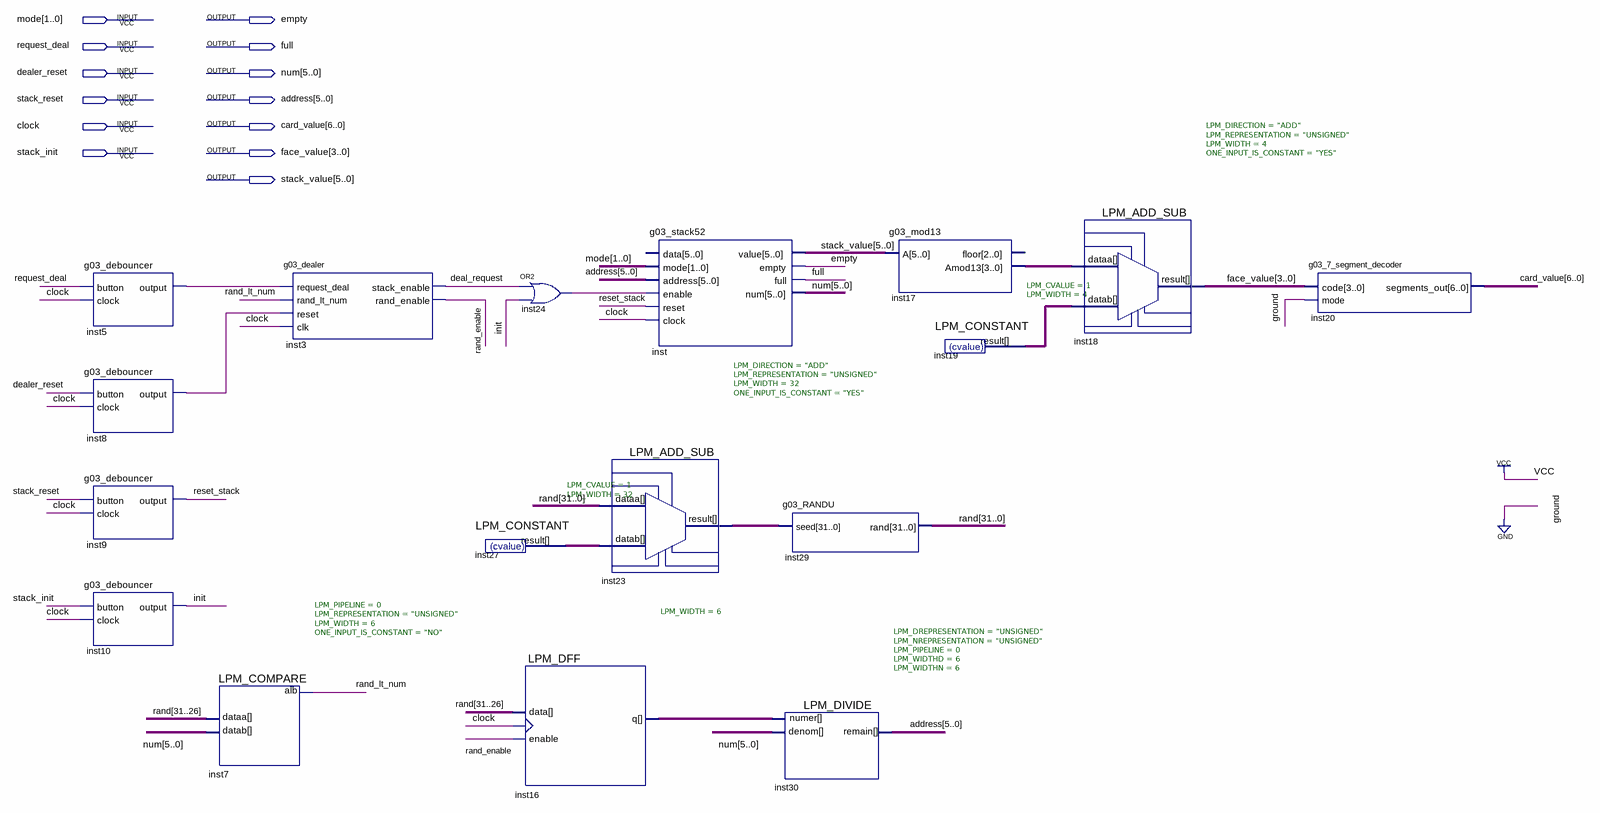
[diagram p0: schematic sheet]
// Quartus schematic g03_testbed_dealer_mod.bdf as structural Verilog: 17 symbols, 13 pins
module g03_testbed_dealer_mod (
  input  [1:0] mode,
  input  request_deal,
  input  dealer_reset,
  input  stack_reset,
  input  clock,
  input  stack_init,
  output empty,
  output full,
  output [5:0] num,
  output [5:0] address,
  output [6:0] card_value,
  output [3:0] face_value,
  output [5:0] stack_value
);

  wire deal_request, init, inst5_output, inst8_output, inst24_out, rand_enable, rand_lt_num, reset_stack;
  wire [3:0] inst17_amod13, inst19_result;
  wire [5:0] inst16_q;
  wire [31:0] inst23_result, inst27_result, \rand ;

  g03_debouncer inst5 (.button(request_deal), .clock(clock), .\output (inst5_output));
  g03_debouncer inst8 (.button(dealer_reset), .clock(clock), .\output (inst8_output));
  g03_debouncer inst9 (.button(stack_reset), .clock(clock), .\output (reset_stack));
  g03_debouncer inst10 (.button(stack_init), .clock(clock), .\output (init));
  LPM_COMPARE #(.LPM_PIPELINE(0), .LPM_REPRESENTATION("UNSIGNED"), .LPM_WIDTH(6), .ONE_INPUT_IS_CONSTANT("NO")) inst7 (
    .dataa(\rand [31:26]), .datab(num), .alb(rand_lt_num));
  g03_dealer inst3 (
    .request_deal(inst5_output), .rand_lt_num(rand_lt_num), .reset(inst8_output), .clk(clock),
    .stack_enable(deal_request), .rand_enable(rand_enable));
  LPM_CONSTANT #(.LPM_CVALUE(1), .LPM_WIDTH(32)) inst27 (.result(inst27_result));
  LPM_DFF #(.LPM_WIDTH(6)) inst16 (.clock(clock), .data(\rand [31:26]), .enable(rand_enable), .q(inst16_q));
  or inst24 (inst24_out, deal_request, init);
  LPM_ADD_SUB #(.LPM_DIRECTION("ADD"), .LPM_REPRESENTATION("UNSIGNED"), .LPM_WIDTH(32), .ONE_INPUT_IS_CONSTANT("YES")) inst23 (
    .dataa(\rand ), .datab(inst27_result), .result(inst23_result));
  g03_stack52 inst (
    .mode(mode), .address(address), .enable(inst24_out), .reset(reset_stack), .clock(clock),
    .value(stack_value), .empty(empty), .full(full), .num(num));  // open: data
  g03_RANDU inst29 (.seed(inst23_result), .\rand (\rand ));
  LPM_DIVIDE #(.LPM_DREPRESENTATION("UNSIGNED"), .LPM_NREPRESENTATION("UNSIGNED"), .LPM_PIPELINE(0), .LPM_WIDTHD(6), .LPM_WIDTHN(6)) inst30 (
    .denom(num), .numer(inst16_q), .remain(address));
  g03_mod13 inst17 (.A(stack_value), .Amod13(inst17_amod13));  // open: floor
  LPM_CONSTANT #(.LPM_CVALUE(1), .LPM_WIDTH(4)) inst19 (.result(inst19_result));
  LPM_ADD_SUB #(.LPM_DIRECTION("ADD"), .LPM_REPRESENTATION("UNSIGNED"), .LPM_WIDTH(4), .ONE_INPUT_IS_CONSTANT("YES")) inst18 (
    .dataa(inst17_amod13), .datab(inst19_result), .result(face_value));
  g03_7_segment_decoder inst20 (.code(face_value), .mode(1'b0), .segments_out(card_value));
endmodule
